# EAGLE design main (EAGLE 9.6.2)
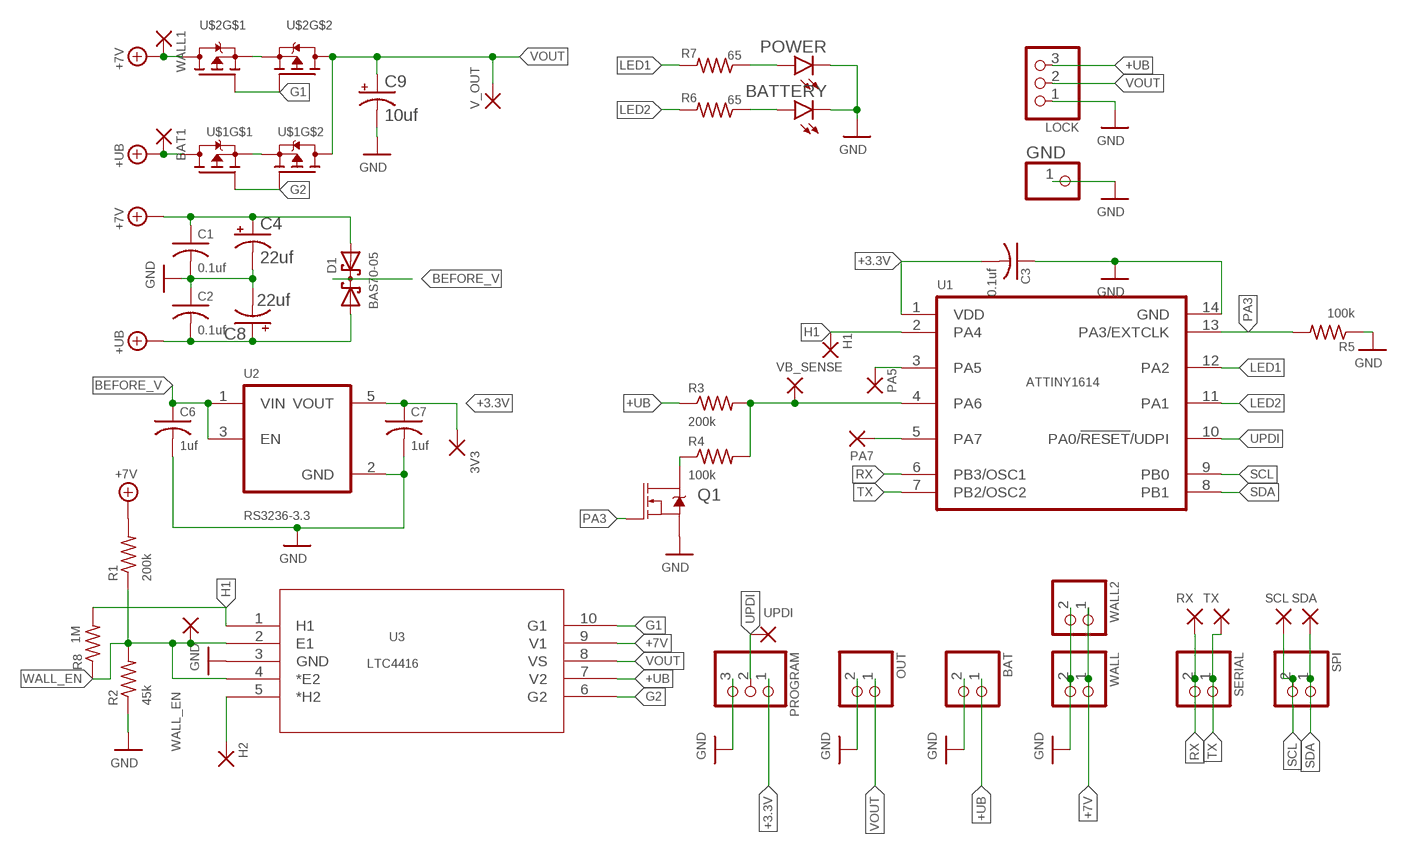
[diagram p0: schematic, sheet 1]

## Parts
3V3  SMD2  [SMD1,27-2,54]
BAT  PINHD-1X2  [1X02]
BAT1  SMD2  [SMD1,27-2,54]
BATTERY  LED5MM  [LED5MM]
C1  0.1uf  C-USC0805  [C0805]
C2  0.1uf  C-USC0805  [C0805]
C3  0.1uf  C-USC0805  [C0805]
C4  22uf  CPOL-US153CLV-0405  [153CLV-0405]
C6  1uf  C-USC1210  [C1210]
C7  1uf  C-USC1210  [C1210]
C8  22uf  CPOL-US153CLV-0405  [153CLV-0405]
C9  10uf  CPOL-US153CLV-0405  [153CLV-0405]
D1  BAS70-05  [SOT23]
GND  PINHD-1X1  [1X01]
H1  SMD2  [SMD1,27-2,54]
H2  SMD2  [SMD1,27-2,54]
LOCK  PINHD-1X3  [1X03]
OUT  PINHD-1X2  [1X02]
PA5  SMD2  [SMD1,27-2,54]
PA7  SMD2  [SMD1,27-2,54]
POWER  LED5MM  [LED5MM]
PROGRAM  PINHD-1X3  [1X03]
Q1  310mA/60V/1.6Ω  MOSFET-NCH-2N7002PW  [SOT323]
R1  200k  R-US_R0805  [R0805]
R2  45k  R-US_R0805  [R0805]
R3  200k  R-US_R0805  [R0805]
R4  100k  R-US_R0805  [R0805]
R5  100k  R-US_R0805  [R0805]
R6  65  R-US_R0805  [R0805]
R7  65  R-US_R0805  [R0805]
R8  1M  R-US_R0805  [R0805]
RX  SMD2  [SMD1,27-2,54]
SCL  SMD2  [SMD1,27-2,54]
SDA  SMD2  [SMD1,27-2,54]
SERIAL  PINHD-1X2  [1X02]
SPI  PINHD-1X2  [1X02]
TX  SMD2  [SMD1,27-2,54]
U1  ATTINY1614  ATTINY1614-SSNR  [SOIC127P600X175-14N]
U2  RS3236-3.3  AP2112K-3.3TRG1  [SOT95P285X140-5N]
U3  LTC4416  LTC4416IMS#PBF  [MSOP-10_MS]
U$1  IRF7314PBF  [SO-8]
U$2  IRF7314PBF  [SO-8]
UPDI  SMD2  [SMD1,27-2,54]
V_OUT  SMD2  [SMD1,27-2,54]
VB_SENSE  SMD2  [SMD1,27-2,54]
WALL  PINHD-1X2  [1X02]
WALL1  SMD2  [SMD1,27-2,54]
WALL2  PINHD-1X2  [1X02]
WALL_EN  SMD2  [SMD1,27-2,54]

## Nets
+3.3V: 3V3.1(P) C3.2 C7.1 PROGRAM.1 U1.1(VDD) U2.5(VOUT)
+7V: C1.1 C4.+ D1.2(A2) R1.2 U3.9(V1) U$2.7(D) U$2.8(D) WALL1.1(P) WALL2.1 WALL.1
+UB: BAT1.1(P) BAT.1 C2.2 C8.+ D1.1(A1) LOCK.3 R3.1 U3.7(V2) U$1.7(D) U$1.8(D)
BEFORE_V: C6.1 D1.3(K1K2) U2.1(VIN) U2.3(EN)
G1: U3.10(G1) U$2.2(G) U$2.4(G)
G2: U3.6(G2) U$1.2(G) U$1.4(G)
GND: BAT.2 BATTERY.K(C) C1.2 C2.1 C3.1 C4.- C6.2 C7.2 C8.- C9.- GND.1 LOCK.1 OUT.2 POWER.K(C) PROGRAM.3 Q1.2(S) R2.1 R5.1 U1.14(GND) U2.2(GND) U3.3(GND) WALL2.2 WALL.2
H1: H1.1(P) R8.2 U1.2(PA4) U3.1(H1)
LED1: R7.2 U1.12(PA2)
LED2: R6.2 U1.11(PA1)
N$1: R3.2 R4.2 U1.4(PA6) VB_SENSE.1(P)
N$2: PA7.1(P) U1.5(PA7)
N$3: U$1.1(S) U$1.3(S)
N$4: U$2.1(S) U$2.3(S)
N$5: POWER.A R7.1
N$6: H2.1(P) U3.5(*H2)
N$7: Q1.3(D) R4.1
N$8: PA5.1(P) U1.3(PA5)
N$11: BATTERY.A R6.1
PA3: Q1.1(G) R5.2 U1.13(PA3/EXTCLK)
RX: RX.1(P) SERIAL.2 U1.6(PB3/OSC1)
SCL: SCL.1(P) SPI.2 U1.9(PB0)
SDA: SDA.1(P) SPI.1 U1.8(PB1)
TX: SERIAL.1 TX.1(P) U1.7(PB2/OSC2)
UPDI: PROGRAM.2 U1.10(PA0/!RESET!/UDPI) UPDI.1(P)
VOUT: C9.+ LOCK.2 OUT.1 U3.8(VS) U$1.5(D) U$1.6(D) U$2.5(D) U$2.6(D) V_OUT.1(P)
WALL_EN: R1.1 R2.2 R8.1 U3.2(E1) U3.4(*E2) WALL_EN.1(P)

## Library data of the parts
3V3 BAT1 H1 H2 PA5 PA7 RX SCL SDA TX UPDI V_OUT VB_SENSE WALL1 WALL_EN = wirepad:SMD2: SMD PAD
BAT OUT SERIAL SPI WALL WALL2 = pinhead:PINHD-1X2: PIN HEADER
BATTERY POWER = led:LED: LED OSRAM: - CHIPLED LG R971, LG N971, LY N971, LG Q971, LY Q971, LO R971, LY R971 LH N974, LH R974 LS Q976, LO Q976, LY Q976 LO Q996 - Hyper CHIPLED LW Q18S LB Q993, LB Q99A, LB R99A - SideLED LS A670, LO A670, LY A670, LG A670, LP A670 LB A673, LV A673, LT A673, LW A673 LH A674 LY A675 LS A676, LA A676, LO A676, LY A676, LW A676 LS A679, LY A679, LG A679 - Hyper Micro SIDELED® LS Y876, LA Y876, LO Y876, LY Y876 LT Y87S - SmartLED LW L88C, LW L88S LB L89C, LB L89S, LG L890 LS L89K, LO L89K, LY L89K LS L896, LA L896, LO L896, LY L896 - TOPLED LS T670, LO T670, LY T670, LG T670, LP T670 LSG T670, LSP T670, LSY T670, LOP T670, LYG T670 LG T671, LOG T671, LSG T671 LB T673, LV T673, LT T673, LW T673 LH T674 LS T676, LA T676, LO T676, LY T676, LB T676, LH T676, LSB T676, LW T676 LB T67C, LV T67C, LT T67C, LS T67K, LO T67K, LY T67K, LW E67C LS E67B, LA E67B, LO E67B, LY E67B, LB E67C, LV E67C, LT E67C LW T67C LS T679, LY T679, LG T679 LS T770, LO T770, LY T770, LG T770, LP T770 LB T773, LV T773, LT T773, LW T773 LH T774 LS E675, LA E675, LY E675, LS T675 LS T776, LA T776, LO T776, LY T776, LB T776 LHGB T686 LT T68C, LB T68C - Hyper Mini TOPLED® LB M676 - Mini TOPLED Santana® LG M470 LS M47K, LO M47K, LY M47K Source: http://www.osram.convergy.de LUXEON: - LUMILED® LXK2-PW12-R00, LXK2-PW12-S00, LXK2-PW14-U00, LXK2-PW14-V00 LXK2-PM12-R00, LXK2-PM12-S00, LXK2-PM14-U00 LXK2-PE12-Q00, LXK2-PE12-R00, LXK2-PE12-S00, LXK2-PE14-T00, LXK2-PE14-U00 LXK2-PB12-K00, LXK2-PB12-L00, LXK2-PB12-M00, LXK2-PB14-N00, LXK2-PB14-P00, LXK2-PB14-Q00 LXK2-PR12-L00, LXK2-PR12-M00, LXK2-PR14-Q00, LXK2-PR14-R00 LXK2-PD12-Q00, LXK2-PD12-R00, LXK2-PD12-S00 LXK2-PH12-R00, LXK2-PH12-S00 LXK2-PL12-P00, LXK2-PL12-Q00, LXK2-PL12-R00 Source: www.luxeon.com KINGBRIGHT: KA-3528ASYC Source: www.kingbright.com
C1-C3 C6 C7 = rcl:C-US: CAPACITOR, American symbol; SPICEPREFIX: C
C4 C8 C9 = rcl:CPOL-US: POLARIZED CAPACITOR, American symbol; SPICEPREFIX: C
D1 = BAS70-05:BAS70-05: General-purpose Schottky diodes General-purpose Schottky diodes in small Surface-Mounted Device (SMD) plastic packages AAL Eindhoven MK Check availability <https://pricing.snapeda.com/parts/BAS70-05/NXP%20Semiconductors/view-part?ref=eda>; AVAILABILITY: In Stock; DESCRIPTION: Diode Array 1 Pair Common Cathode Schottky 70V 70mA (DC) Surface Mount TO-236-3, SC-59, SOT-23-3; MF: NXP Semiconductors; MP: BAS70-05; PACKAGE: SOT-23 ON; PRICE: None; PURCHASE-URL: https://pricing.snapeda.com/search/part/BAS70-05/?ref=eda
GND = pinhead:PINHD-1X1: PIN HEADER
LOCK PROGRAM = pinhead:PINHD-1X3: PIN HEADER
Q1 = SparkFun-DiscreteSemi:MOSFET-NCH: N-channel MOSFETs Voltage controlled devices that allow control of high current outputs. SparkFun Products: SparkFun OpenScale <https://www.sparkfun.com/products/13261> SparkFun Digital Sandbox <https://www.sparkfun.com/products/12651> SparkFun Monster Moto Shield <https://www.sparkfun.com/products/10182> SparkFun MOSFET Power Controller <https://www.sparkfun.com/products/11214>; PROD_ID: TRANS-11151
R1-R8 = rcl:R-US_: RESISTOR, American symbol; SPICEPREFIX: R
U1 = CustomParts:ATTINY1614-SSNR: 20MHz, SOIC, 85C, Green, 14 SOIC .150in T/R Check availability <https://pricing.snapeda.com/parts/ATTINY1614-SSNR/Microchip/view-part?ref=eda>; AVAILABILITY: In Stock; DESCRIPTION: AVR tinyAVR™ 1, Functional Safety (FuSa) Microcontroller IC 8-Bit 20MHz 16KB (16K x 8) FLASH 14-SOIC; MF: Microchip; MP: ATTINY1614-SSNR; PACKAGE: SO-14 Microchip; PRICE: None; PURCHASE-URL: https://pricing.snapeda.com/search/part/ATTINY1614-SSNR/?ref=eda
U2 = AP2112K-3.3TRG1:AP2112K-3.3TRG1: AP2112 Series 0.6 A 3.3 V Fixed Output SMT LDO Linear Regulator - SOT23-5 Check availability <https://pricing.snapeda.com/parts/AP2112K-3.3TRG1/Diodes%20Inc./view-part?ref=eda>; AVAILABILITY: In Stock; DESCRIPTION: Linear Voltage Regulator IC Positive Fixed 1 Output 600mA SOT-25; MF: Diodes Inc.; MP: AP2112K-3.3TRG1; PACKAGE: SOT-753 Diodes Inc.; PRICE: None; PURCHASE-URL: https://pricing.snapeda.com/search/part/AP2112K-3.3TRG1/?ref=eda
U3 = LTC4416IMS_PBF:LTC4416IMS#PBF: Check availability <https://pricing.snapeda.com/parts/LTC4416IMS%23PBF/Analog%20Devices/view-part?ref=eda>; AVAILABILITY: In Stock; DESCRIPTION: OR Controller Source Selector Switch P-Channel 2:2 10-MSOP; MF: Analog Devices; MP: LTC4416IMS#PBF; PACKAGE: MSOP-10 Linear Technology; PRICE: None; PURCHASE-URL: https://pricing.snapeda.com/search/part/LTC4416IMS#PBF/?ref=eda
U$1 U$2 = IRF7314PBF:IRF7314PBF: Check availability <https://pricing.snapeda.com/parts/IRF7314PBF/Infineon/view-part?ref=eda>; AVAILABILITY: In Stock; DESCRIPTION: Mosfet Array 2 P-Channel (Dual) 20V 5.3A 2W Surface Mount 8-SO; MF: Infineon; MP: IRF7314PBF; PACKAGE: SOIC-8 International Rectifier; PRICE: None; PURCHASE-URL: https://pricing.snapeda.com/search/part/IRF7314PBF/?ref=eda

## Board
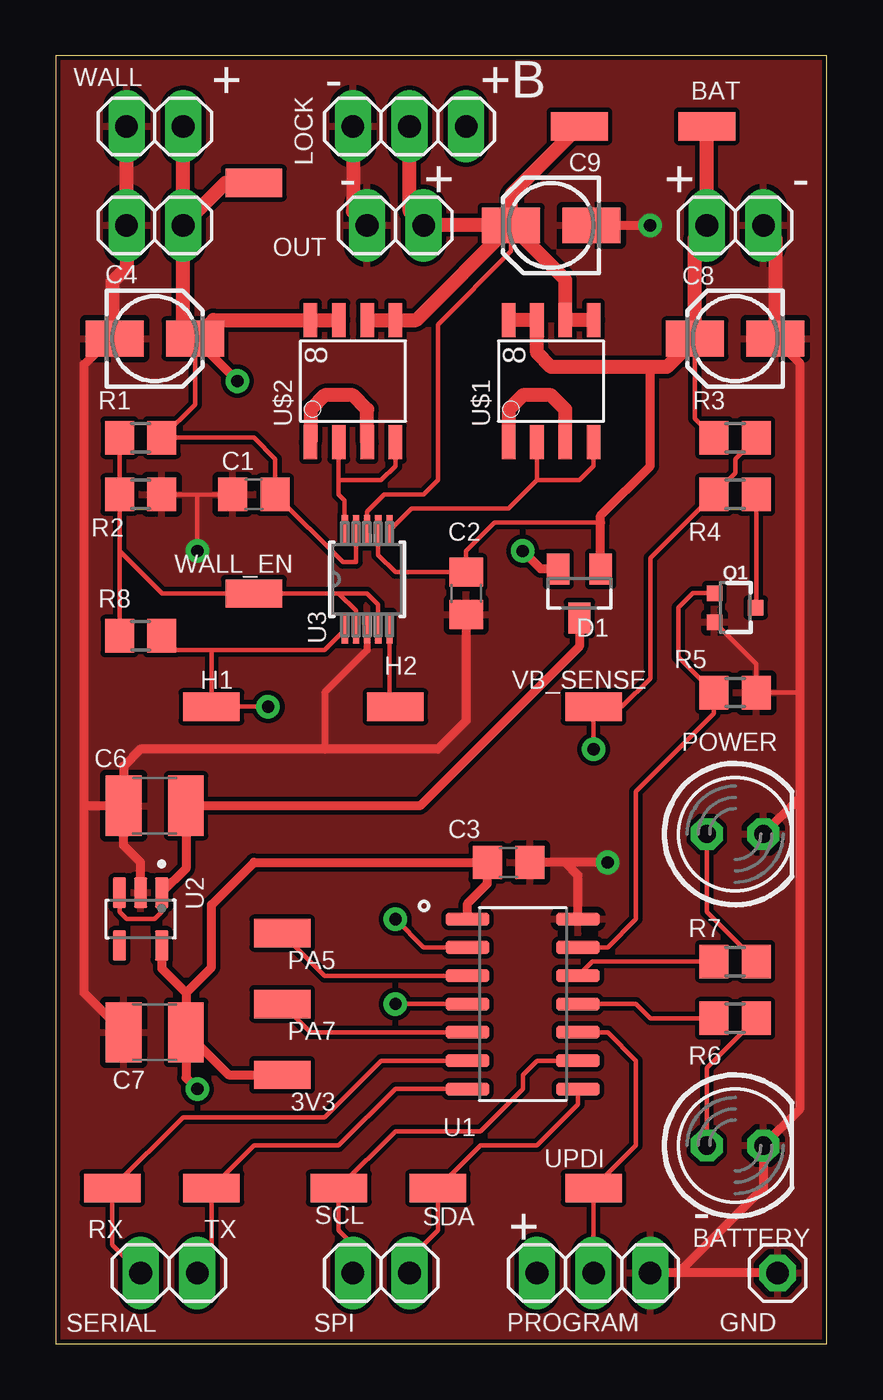
[diagram p1: board, top side]
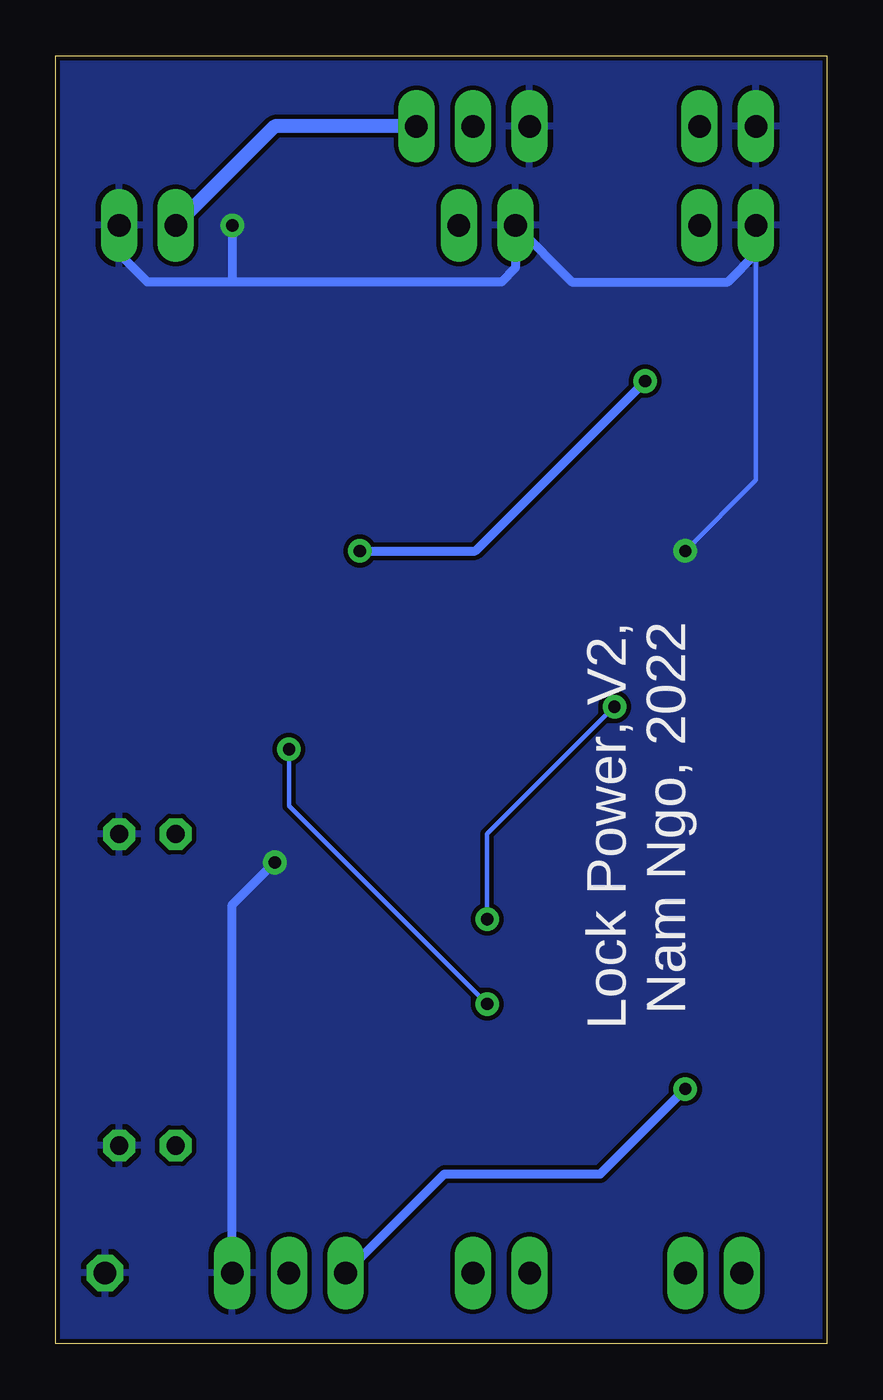
[diagram p2: board, bottom side, seen from below]

Size 34.59 x 57.77 mm. Coordinates in mm from the lower left corner, seen from the top.
Outline: 0,0 34.59,0 34.59,57.77 0,57.77 0,0
Copper layers (1*16): Top 0.035mm / dielectric 1.5mm / Bottom 0.035mm
Design rules "SparkFun": minimum track width 8mil, minimum drill 20mil, track to track 8mil, track to pad 8mil, pad to pad 8mil, via to via 8mil, smd to smd 8mil, copper to edge 8mil, drill to drill 8mil, minimum pad ring 12mil, minimum via ring 10mil, stop-mask expansion 4mil, vias tented up to drill 20mil, thermal gap 10mil

### Footprints (pad centres in the part's own frame; a part is rotated, then mirrored left to right if it is on the bottom)
SMD1,27-2,54 = smd 1.27 x 2.54: 1 0,0
1X02 = drill 1.016 long: 1 -1.27,0; 2 1.27,0
LED5MM = drill 0.813 octagon: A -1.27,0; K 1.27,0
C0805 = smd 1.3 x 1.5: 1 -0.95,0; 2 0.95,0
153CLV-0405 = smd 2.6 x 1.6: + 1.8,0; - -1.8,0
C1210 = smd 1.6 x 2.7: 1 -1.4,0; 2 1.4,0
SOT23 = smd 1 x 1.4: 1 -0.95,-1.1; 2 0.95,-1.1; 3 0,1.1
1X01 = drill 1.016 octagon: 1 0,0
1X03 = drill 1.016 long: 1 -2.54,0; 2 0,0; 3 2.54,0
SOT323 = smd 0.7 x 0.7: 1 -0.65,-0.925; 2 0.65,-0.925; 3 0,0.925
R0805 = smd 1.3 x 1.5: 1 -0.95,0; 2 0.95,0
SOIC127P600X175-14N = smd 1.95 x 0.59: 1 -2.48,3.81; 2 -2.48,2.54; 3 -2.48,1.27; 4 -2.48,0; 5 -2.48,-1.27; 6 -2.48,-2.54; 7 -2.48,-3.81; 8 2.48,-3.81; 9 2.48,-2.54; 10 2.48,-1.27; 11 2.48,0; 12 2.48,1.27; 13 2.48,2.54; 14 2.48,3.81
SOT95P285X140-5N = smd 1.35 x 0.6: 1 -1.185,0.95; 2 -1.185,0; 3 -1.185,-0.95; 4 1.185,-0.95; 5 1.185,0.95
MSOP-10_MS = smd 1.397 x 0.279: 1 -2.184,1.001; 2 -2.184,0.5; 3 -2.184,0; 4 -2.184,-0.5; 5 -2.184,-1.001; 6 2.184,-1.001; 7 2.184,-0.5; 8 2.184,0; 9 2.184,0.5; 10 2.184,1.001
SO-8 = smd 1.524 x 0.61: 1 -2.743,1.905; 2 -2.743,0.635; 3 -2.743,-0.635; 4 -2.743,-1.905; 5 2.743,-1.905; 6 2.743,-0.635; 7 2.743,0.635; 8 2.743,1.905

### Placement (x,y rotation side)
3V3  10.16,12.06 90 top
BAT  30.48,50.16 0 top
BAT1  29.21,54.61 90 top
BATTERY  30.48,8.89 0 top
C1  8.89,38.1 180 top
C2  18.41,33.66 90 top
C3  20.32,21.59 180 top
C4  4.45,45.09 0 top
C6  4.45,24.13 180 top
C7  4.45,13.97 180 top
C8  30.48,45.09 180 top
C9  22.23,50.16 180 top
D1  23.5,33.66 180 top
GND  32.38,3.17 0 top
H1  6.99,28.57 270 top
H2  15.24,28.57 270 top
LOCK  15.88,54.61 0 top
OUT  15.24,50.16 180 top
PA5  10.16,18.41 90 top
PA7  10.16,15.24 90 top
POWER  30.48,22.86 0 top
PROGRAM  24.13,3.17 0 top
Q1  30.48,33.02 270 top
R1  3.81,40.64 0 top
R2  3.81,38.1 180 top
R3  30.48,40.64 0 top
R4  30.48,38.1 180 top
R5  30.48,29.21 180 top
R6  30.48,14.61 180 top
R7  30.48,17.14 180 top
R8  3.81,31.75 0 top
RX  2.54,6.99 90 top
SCL  12.7,6.99 90 top
SDA  17.14,6.99 270 top
SERIAL  5.08,3.17 180 top
SPI  14.61,3.17 180 top
TX  6.99,6.99 90 top
U1  20.95,15.24 0 top
U2  3.81,19.05 270 top
U3  13.97,34.29 90 top
U$1  22.23,43.18 90 top
U$2  13.34,43.18 90 top
UPDI  24.13,6.99 90 top
V_OUT  23.5,54.61 90 top
VB_SENSE  24.13,28.57 270 top
WALL  4.45,50.16 180 top
WALL1  8.89,52.07 90 top
WALL2  4.45,54.61 180 top
WALL_EN  8.89,33.66 90 top

### Tracks (layer width: path | path; a pad name or v marks a point on that pad's centre or on a via)
+3.3V  (via drill 0.55)
  Top 0.406: U2.5 4.76,16.83 5.84,15.74 | 5.84,15.74 C7.1 | U1.1 18.48,19.75 19.37,20.64 C3.2 8.89,21.59 6.99,19.68 6.99,16.89 5.84,15.74 | C7.1 7.75,12.06 3V3.1 | C7.1 5.84,11.94 v6.35,11.43
  Bottom 0.406: PROGRAM.1 17.14,7.62 10.16,7.62 v6.35,11.43
+7V  (via drill 0.55)
  Top 0.203: C4.+ 6.25,42.12 R1.2 8.89,40.64 9.84,39.69 C1.1 12.88,35.06 13.47,35.06 U3.9
  Top 0.406: D1.2 21.76,34.76 v20.95,35.56 | v8.15,43.18 C4.+
  Top 0.635: WALL.1 5.71,45.62 C4.+ 7.08,45.92 U$2.8 U$2.7 | WALL.1 7.62,52.07 WALL1.1 | WALL.1 WALL2.1
  Bottom 0.406: v20.95,35.56 15.77,35.56 v8.15,43.18
+UB
  Top 0.203: U3.7 14.47,35.38 15.24,34.6 C2.2 18.41,35.56 19.68,36.83 24.45,36.83 | R3.1 28.68,41.49 C8.+
  Top 0.406: D1.1 24.45,36.83 24.45,37.15 26.67,39.37 26.67,43.81
  Top 0.635: U$1.8 U$1.7 21.59,44.45 22.23,43.81 26.67,43.81 27.41,43.81 C8.+ 28.68,49.63 BAT.1 BAT1.1
  Bottom 0.635: LOCK.3 24.77,54.61 BAT.1
BEFORE_V
  Top 0.203: U2.1 4.76,19.36 4.45,19.05 3.17,19.05 2.86,19.36 U2.3
  Top 0.406: D1.3 23.5,31.29 16.34,24.13 C6.1 5.84,21.32 U2.1
G1
  Top 0.203: U3.10 12.97,37.83 12.7,38.1 12.7,38.73 | 12.7,38.73 U$2.2 | 12.7,38.73 14.61,38.73 15.24,39.37 U$2.4
G2
  Top 0.203: U3.6 15.96,37.47 20.32,37.47 21.59,38.73 | 21.59,38.73 U$1.2 | 21.59,38.73 23.5,38.73 24.13,39.37 U$1.4
GND  (via drill 0.55)
  Top 0.203: Q1.2 31.43,30.5 R5.1 33.38,29.21 | C1.2 6.35,38.1 | R2.1 6.35,38.1 | 6.35,38.1 v6.35,35.56
  Top 0.305: U3.3 13.97,31.11 12.06,29.21 12.06,26.67
  Top 0.406: U2.2 3.81,21.59 3.04,22.36 C6.2 | C6.2 3.04,25.91 3.81,26.67 12.06,26.67 17.14,26.67 18.41,27.94 C2.1 | C7.2 1.27,15.74 1.27,24.13 | 2.54,45.19 1.27,43.92 1.27,24.13 | C6.2 1.27,24.13 | U1.14 23.43,21.02 22.86,21.59 | 22.86,21.59 C3.1 | v24.77,21.59 22.86,21.59 | C9.- v26.67,50.16 | C8.- 33.38,43.99 33.38,29.21 33.38,24.49 | 33.38,24.49 POWER.K | 33.38,24.49 33.38,10.52 BATTERY.K 31.75,6.99 27.94,3.17 | 27.94,3.17 PROGRAM.3 | GND.1 27.94,3.17
  Top 0.635: BAT.2 32.28,49.63 C8.- | C4.- 2.54,45.19 2.54,47.62 3.17,48.26 WALL.2 WALL2.2 | LOCK.1 13.34,50.8 OUT.2
  Bottom 0.203: v6.35,35.56 3.17,38.73 3.17,49.53
  Bottom 0.406: PROGRAM.3 26.67,19.68 v24.77,21.59 | WALL.2 3.17,49.53 3.17,48.9 4.45,47.62 11.43,47.62 OUT.2 13.97,48.26 14.61,47.62 26.67,47.62 | 26.67,47.62 30.48,47.62 31.75,48.9 BAT.2 | v26.67,50.16 26.67,47.62
  pour Top (isolate 0.152): 0,57.78 34.92,57.78 34.92,0 0,0
  pour Bottom (isolate 0.152): 0,57.78 34.92,57.78 34.92,0 0,0
H1  (via drill 0.55)
  Top 0.203: U3.1 12.97,32.02 12.06,31.11 6.99,31.11 | R8.2 5.39,31.11 6.99,31.11 | 6.99,31.11 H1.1 v9.53,28.57 | v15.24,19.05 16.51,17.78 U1.2
  Bottom 0.203: v9.53,28.57 15.24,22.86 v15.24,19.05
LED1
  Top 0.203: R7.2 24.07,17.14 U1.12
LED2
  Top 0.203: U1.11 26.04,15.24 26.67,14.61 R6.2
N$1  (via drill 0.55)
  Top 0.203: R3.2 30.48,39.69 30.48,39.05 R4.2 26.67,35.24 26.67,29.84 25.4,28.57 VB_SENSE.1 v24.13,26.67 | U1.4 v15.24,15.24
  Bottom 0.203: v15.24,15.24 24.13,24.13 v24.13,26.67
N$2
  Top 0.203: U1.5 11.43,13.97 PA7.1
N$3
  Top 0.635: U$1.3 22.86,41.91 22.23,42.55 20.95,42.55 20.32,41.91 U$1.1
N$4
  Top 0.635: U$2.3 13.97,41.91 13.34,42.55 12.06,42.55 11.43,41.91 U$2.1
N$5
  Top 0.203: R7.1 29.21,19.36 POWER.A
N$6
  Top 0.203: H2.1 14.97,28.84 U3.5
N$7
  Top 0.203: R4.1 31.43,33.05 Q1.3
N$8
  Top 0.203: U1.3 12.06,16.51 PA5.1
N$11
  Top 0.203: BATTERY.A 29.21,12.38 R6.1
PA3
  Top 0.203: Q1.1 28.59,33.67 27.94,33.02 27.94,30.8 R5.2 29.53,28.26 26.04,24.77 26.04,19.05 24.77,17.78 U1.13
RX
  Top 0.203: U1.6 14.61,12.7 12.06,10.16 5.71,10.16 RX.1 2.54,4.45 SERIAL.2
SCL
  Top 0.203: U1.9 21.59,12.7 20.95,12.06 20.95,11.43 19.05,9.53 15.24,9.53 SCL.1 12.7,5.08 13.34,4.45 SPI.2
SDA
  Top 0.203: U1.8 23.43,10.73 21.59,8.89 19.05,8.89 SDA.1 17.14,5.08 15.88,3.81 SPI.1
TX
  Top 0.203: U1.7 15.24,11.43 12.7,8.89 8.89,8.89 TX.1 6.99,3.81 SERIAL.1
UPDI
  Top 0.203: U1.10 24.77,13.97 26.04,12.7 26.04,8.89 UPDI.1 PROGRAM.2
VOUT
  Top 0.203: U3.8 13.97,37.34 14.73,38.1 16.51,38.1 17.14,38.73 17.14,45.72 20.43,49 C9.+
  Top 0.635: U$1.5 U$1.6 22.86,47.73 C9.+ | U$2.6 U$2.5 16.18,45.92 C9.+ | LOCK.2 15.88,50.8 OUT.1 C9.+ | C9.+ 20.43,51.54 V_OUT.1
WALL_EN
  Top 0.203: U3.2 13.47,32.88 12.7,33.66 | 12.7,33.66 13.97,33.66 14.47,33.16 U3.4 | 12.7,33.66 WALL_EN.1 4.76,33.66 2.86,35.56 | R1.1 R2.2 2.86,35.56 | R8.1 2.86,35.56

### Text on the board
tPlace: + | - | +B | - | + | + | - | - | +
bPlace: Lock Power, V2, / Nam Ngo, 2022